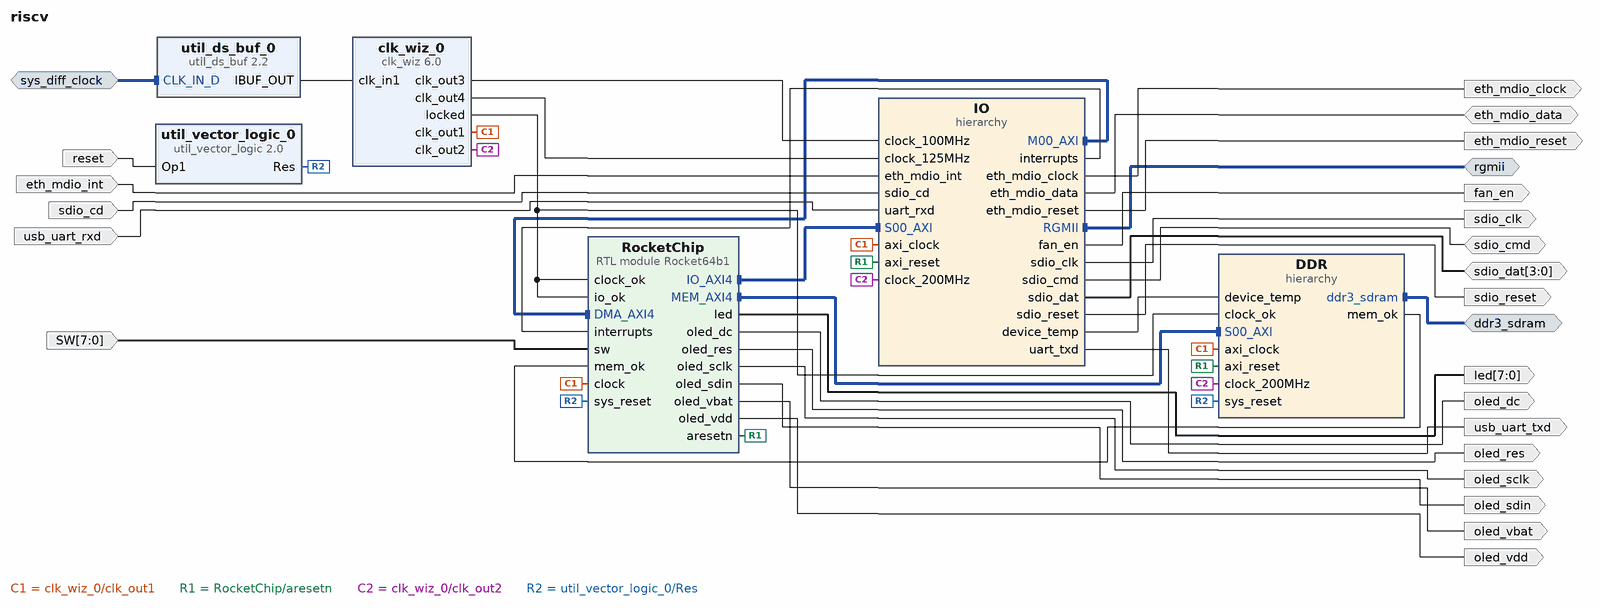
[diagram p0: block diagram of the top level]
# Vivado block design riscv, xc7k325tffg900-2, Vivado 2021.2
create_bd_design riscv

create_bd_intf_port -mode Master -vlnv xilinx.com:interface:ddrx_rtl:1.0 ddr3_sdram
create_bd_intf_port -mode Master -vlnv xilinx.com:interface:rgmii_rtl:1.0 rgmii
create_bd_intf_port -mode Slave -vlnv xilinx.com:interface:diff_clock_rtl:1.0 sys_diff_clock
set_property -dict {CONFIG.FREQ_HZ 200000000} [get_bd_intf_ports sys_diff_clock]
create_bd_port -dir O -from 7 -to 0 led
create_bd_port -dir I -from 7 -to 0 SW
create_bd_port -dir O oled_sdin
create_bd_port -dir O oled_sclk
create_bd_port -dir O oled_dc
create_bd_port -dir O oled_res
create_bd_port -dir O oled_vbat
create_bd_port -dir O oled_vdd
create_bd_port -dir O eth_mdio_clock
create_bd_port -dir IO eth_mdio_data
create_bd_port -dir I eth_mdio_int
create_bd_port -dir O eth_mdio_reset
create_bd_port -dir O fan_en
create_bd_port -dir I -type rst reset
set_property -dict {CONFIG.POLARITY ACTIVE_LOW} [get_bd_ports reset]
create_bd_port -dir I sdio_cd
create_bd_port -dir O sdio_clk
create_bd_port -dir IO sdio_cmd
create_bd_port -dir IO -from 3 -to 0 sdio_dat
create_bd_port -dir O -type rst sdio_reset
create_bd_port -dir I usb_uart_rxd
create_bd_port -dir O usb_uart_txd

create_bd_cell -type hier DDR
create_bd_cell -type hier IO
create_bd_cell -type ip -vlnv xilinx.com:ip:clk_wiz:6.0 clk_wiz_0
set_property -dict [list \
  CONFIG.CLKOUT1_REQUESTED_OUT_FREQ 100.0 \
  CONFIG.CLKOUT2_REQUESTED_OUT_FREQ 200.000 \
  CONFIG.CLKOUT2_USED true \
  CONFIG.CLKOUT3_REQUESTED_OUT_FREQ 100.000 \
  CONFIG.CLKOUT3_USED true \
  CONFIG.CLKOUT4_REQUESTED_OUT_FREQ 125.000 \
  CONFIG.CLKOUT4_USED true \
  CONFIG.NUM_OUT_CLKS 4 \
  CONFIG.PRIM_SOURCE No_buffer \
  CONFIG.USE_PHASE_ALIGNMENT false \
  CONFIG.USE_RESET false \
] [get_bd_cells clk_wiz_0]
create_bd_cell -type ip -vlnv xilinx.com:ip:util_ds_buf:2.2 util_ds_buf_0
set_property -dict {CONFIG.DIFF_CLK_IN_BOARD_INTERFACE sys_diff_clock CONFIG.USE_BOARD_FLOW true} [get_bd_cells util_ds_buf_0]
create_bd_cell -type ip -vlnv xilinx.com:ip:util_vector_logic:2.0 util_vector_logic_0
set_property -dict {CONFIG.C_OPERATION not CONFIG.C_SIZE 1} [get_bd_cells util_vector_logic_0]
create_bd_cell -type module -reference Rocket64b1 RocketChip

# ---- hierarchy /DDR ----
current_bd_instance /DDR
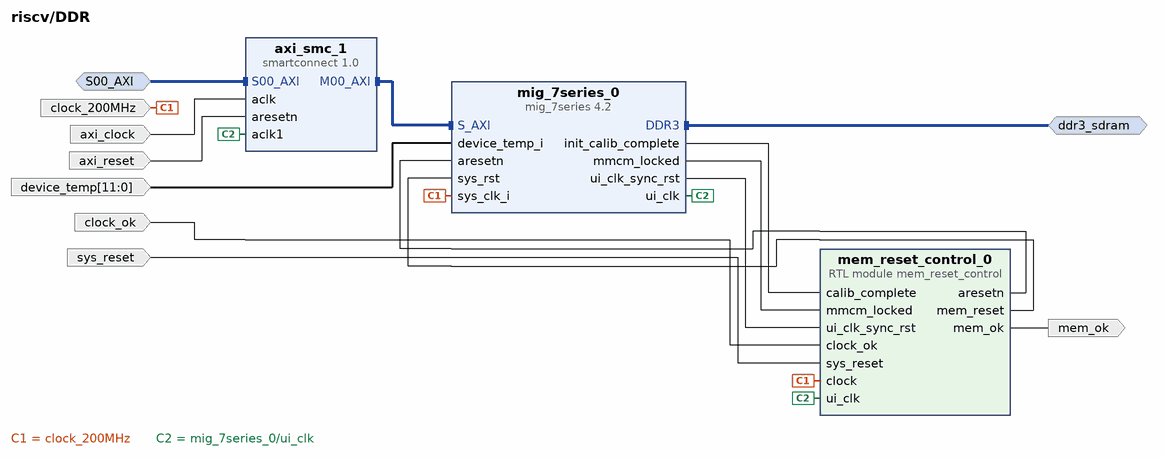
[diagram p1: block diagram inside /DDR]
create_bd_intf_pin -mode Slave -vlnv xilinx.com:interface:aximm_rtl:1.0 S00_AXI
create_bd_intf_pin -mode Master -vlnv xilinx.com:interface:ddrx_rtl:1.0 ddr3_sdram
create_bd_pin -dir I -type clk axi_clock
create_bd_pin -dir I -type rst axi_reset
create_bd_pin -dir I -type clk clock_200MHz
create_bd_pin -dir I clock_ok
create_bd_pin -dir I -from 11 -to 0 device_temp
create_bd_pin -dir O mem_ok
create_bd_pin -dir I -type rst sys_reset

create_bd_cell -type ip -vlnv xilinx.com:ip:smartconnect:1.0 axi_smc_1
set_property -dict {CONFIG.NUM_CLKS 2 CONFIG.NUM_SI 1} [get_bd_cells axi_smc_1]
create_bd_cell -type module -reference mem_reset_control mem_reset_control_0
create_bd_cell -type ip -vlnv xilinx.com:ip:mig_7series:4.2 mig_7series_0
set_property -dict [list \
  CONFIG.BOARD_MIG_PARAM ddr3_sdram \
  CONFIG.MIG_DONT_TOUCH_PARAM Custom \
  CONFIG.RESET_BOARD_INTERFACE Custom \
  CONFIG.XML_INPUT_FILE mig_a.prj \
] [get_bd_cells mig_7series_0]

# ---- hierarchy /IO ----
current_bd_instance /IO
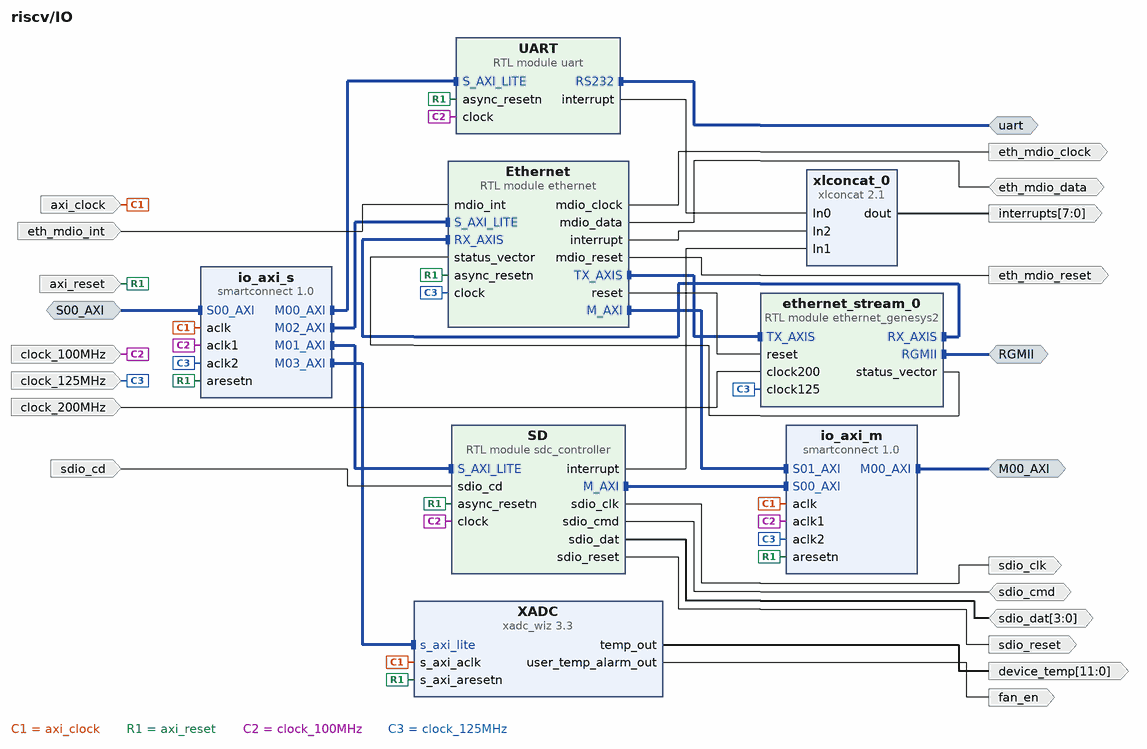
[diagram p2: block diagram inside /IO]
create_bd_intf_pin -mode Master -vlnv xilinx.com:interface:aximm_rtl:1.0 M00_AXI
create_bd_intf_pin -mode Master -vlnv xilinx.com:interface:rgmii_rtl:1.0 RGMII
create_bd_intf_pin -mode Slave -vlnv xilinx.com:interface:aximm_rtl:1.0 S00_AXI
create_bd_intf_pin -mode Master -vlnv xilinx.com:interface:uart_rtl:1.0 uart
create_bd_pin -dir I -type clk axi_clock
create_bd_pin -dir I -type rst axi_reset
create_bd_pin -dir I -type clk clock_100MHz
create_bd_pin -dir I -type clk clock_125MHz
create_bd_pin -dir I -type clk clock_200MHz
create_bd_pin -dir O -from 11 -to 0 device_temp
create_bd_pin -dir O eth_mdio_clock
create_bd_pin -dir IO eth_mdio_data
create_bd_pin -dir I eth_mdio_int
create_bd_pin -dir O eth_mdio_reset
create_bd_pin -dir O fan_en
create_bd_pin -dir O -from 7 -to 0 interrupts
create_bd_pin -dir I sdio_cd
create_bd_pin -dir O sdio_clk
create_bd_pin -dir IO sdio_cmd
create_bd_pin -dir IO -from 3 -to 0 sdio_dat
create_bd_pin -dir O sdio_reset

create_bd_cell -type module -reference ethernet Ethernet
create_bd_cell -type module -reference sdc_controller SD
set_property -dict {CONFIG.sdio_card_detect_level 0} [get_bd_cells SD]
create_bd_cell -type module -reference uart UART
create_bd_cell -type ip -vlnv xilinx.com:ip:xadc_wiz:3.3 XADC
set_property -dict [list \
  CONFIG.ADC_OFFSET_AND_GAIN_CALIBRATION true \
  CONFIG.ADC_OFFSET_CALIBRATION true \
  CONFIG.CHANNEL_ENABLE_VBRAM true \
  CONFIG.CHANNEL_ENABLE_VCCAUX true \
  CONFIG.CHANNEL_ENABLE_VCCINT true \
  CONFIG.CHANNEL_ENABLE_VP_VN true \
  CONFIG.ENABLE_TEMP_BUS true \
  CONFIG.SENSOR_OFFSET_AND_GAIN_CALIBRATION true \
  CONFIG.SENSOR_OFFSET_CALIBRATION true \
  CONFIG.SEQUENCER_MODE Continuous \
  CONFIG.TEMPERATURE_ALARM_RESET 50 \
  CONFIG.TEMPERATURE_ALARM_TRIGGER 60 \
  CONFIG.VCCAUX_ALARM false \
  CONFIG.VCCINT_ALARM false \
  CONFIG.XADC_STARUP_SELECTION channel_sequencer \
] [get_bd_cells XADC]
create_bd_cell -type module -reference ethernet_genesys2 ethernet_stream_0
create_bd_cell -type ip -vlnv xilinx.com:ip:smartconnect:1.0 io_axi_m
set_property -dict {CONFIG.NUM_CLKS 3 CONFIG.NUM_MI 1 CONFIG.NUM_SI 2} [get_bd_cells io_axi_m]
create_bd_cell -type ip -vlnv xilinx.com:ip:smartconnect:1.0 io_axi_s
set_property -dict {CONFIG.NUM_CLKS 3 CONFIG.NUM_MI 4 CONFIG.NUM_SI 1} [get_bd_cells io_axi_s]
create_bd_cell -type ip -vlnv xilinx.com:ip:xlconcat:2.1 xlconcat_0
set_property -dict {CONFIG.NUM_PORTS 8} [get_bd_cells xlconcat_0]

# ---- connections ----

current_bd_instance /DDR
connect_bd_intf_net -intf_net MEM_AXI4 [get_bd_intf_pins S00_AXI] [get_bd_intf_pins axi_smc_1/S00_AXI]
connect_bd_intf_net [get_bd_intf_pins axi_smc_1/M00_AXI] [get_bd_intf_pins mig_7series_0/S_AXI]
connect_bd_intf_net [get_bd_intf_pins ddr3_sdram] [get_bd_intf_pins mig_7series_0/DDR3]
connect_bd_net [get_bd_pins axi_clock] [get_bd_pins axi_smc_1/aclk]
connect_bd_net [get_bd_pins axi_reset] [get_bd_pins axi_smc_1/aresetn]
connect_bd_net [get_bd_pins clock_200MHz] [get_bd_pins mem_reset_control_0/clock] [get_bd_pins mig_7series_0/sys_clk_i]
connect_bd_net [get_bd_pins clock_ok] [get_bd_pins mem_reset_control_0/clock_ok]
connect_bd_net [get_bd_pins device_temp] [get_bd_pins mig_7series_0/device_temp_i]
connect_bd_net -net mem_aresetn [get_bd_pins mem_reset_control_0/aresetn] [get_bd_pins mig_7series_0/aresetn]
connect_bd_net -net mem_init_calib_complete [get_bd_pins mig_7series_0/init_calib_complete] [get_bd_pins mem_reset_control_0/calib_complete]
connect_bd_net -net mem_mmcm_locked [get_bd_pins mig_7series_0/mmcm_locked] [get_bd_pins mem_reset_control_0/mmcm_locked]
connect_bd_net -net mem_ok [get_bd_pins mem_reset_control_0/mem_ok] [get_bd_pins mem_ok]
connect_bd_net -net mem_reset [get_bd_pins mem_reset_control_0/mem_reset] [get_bd_pins mig_7series_0/sys_rst]
connect_bd_net -net mem_ui_clk [get_bd_pins mig_7series_0/ui_clk] [get_bd_pins mem_reset_control_0/ui_clk] [get_bd_pins axi_smc_1/aclk1]
connect_bd_net -net mem_ui_clk_sync_rst [get_bd_pins mig_7series_0/ui_clk_sync_rst] [get_bd_pins mem_reset_control_0/ui_clk_sync_rst]
connect_bd_net [get_bd_pins sys_reset] [get_bd_pins mem_reset_control_0/sys_reset]

current_bd_instance /IO
connect_bd_intf_net -intf_net Ethernet_RGMII [get_bd_intf_pins RGMII] [get_bd_intf_pins ethernet_stream_0/RGMII]
connect_bd_intf_net [get_bd_intf_pins Ethernet/TX_AXIS] [get_bd_intf_pins ethernet_stream_0/TX_AXIS]
connect_bd_intf_net [get_bd_intf_pins Ethernet/M_AXI] [get_bd_intf_pins io_axi_m/S01_AXI]
connect_bd_intf_net [get_bd_intf_pins uart] [get_bd_intf_pins UART/RS232]
connect_bd_intf_net [get_bd_intf_pins Ethernet/RX_AXIS] [get_bd_intf_pins ethernet_stream_0/RX_AXIS]
connect_bd_intf_net [get_bd_intf_pins M00_AXI] [get_bd_intf_pins io_axi_m/M00_AXI]
connect_bd_intf_net [get_bd_intf_pins S00_AXI] [get_bd_intf_pins io_axi_s/S00_AXI]
connect_bd_intf_net [get_bd_intf_pins UART/S_AXI_LITE] [get_bd_intf_pins io_axi_s/M00_AXI]
connect_bd_intf_net [get_bd_intf_pins SD/S_AXI_LITE] [get_bd_intf_pins io_axi_s/M01_AXI]
connect_bd_intf_net [get_bd_intf_pins Ethernet/S_AXI_LITE] [get_bd_intf_pins io_axi_s/M02_AXI]
connect_bd_intf_net [get_bd_intf_pins XADC/s_axi_lite] [get_bd_intf_pins io_axi_s/M03_AXI]
connect_bd_intf_net -intf_net sd_axi_m [get_bd_intf_pins SD/M_AXI] [get_bd_intf_pins io_axi_m/S00_AXI]
connect_bd_net [get_bd_pins axi_clock] [get_bd_pins XADC/s_axi_aclk] [get_bd_pins io_axi_m/aclk] [get_bd_pins io_axi_s/aclk]
connect_bd_net [get_bd_pins axi_reset] \
  [get_bd_pins Ethernet/async_resetn] [get_bd_pins SD/async_resetn] [get_bd_pins UART/async_resetn] \
  [get_bd_pins XADC/s_axi_aresetn] [get_bd_pins io_axi_m/aresetn] [get_bd_pins io_axi_s/aresetn]
connect_bd_net [get_bd_pins Ethernet/interrupt] [get_bd_pins xlconcat_0/In2]
connect_bd_net [get_bd_pins Ethernet/mdio_clock] [get_bd_pins eth_mdio_clock]
connect_bd_net -net Ethernet_mdio_data [get_bd_pins eth_mdio_data] [get_bd_pins Ethernet/mdio_data]
connect_bd_net -net Ethernet_mdio_int [get_bd_pins eth_mdio_int] [get_bd_pins Ethernet/mdio_int]
connect_bd_net [get_bd_pins Ethernet/mdio_reset] [get_bd_pins eth_mdio_reset]
connect_bd_net [get_bd_pins Ethernet/reset] [get_bd_pins ethernet_stream_0/reset]
connect_bd_net -net Ethernet_status [get_bd_pins ethernet_stream_0/status_vector] [get_bd_pins Ethernet/status_vector]
connect_bd_net [get_bd_pins SD/interrupt] [get_bd_pins xlconcat_0/In1]
connect_bd_net -net SD_sdio_cd [get_bd_pins sdio_cd] [get_bd_pins SD/sdio_cd]
connect_bd_net [get_bd_pins SD/sdio_clk] [get_bd_pins sdio_clk]
connect_bd_net -net SD_sdio_cmd [get_bd_pins sdio_cmd] [get_bd_pins SD/sdio_cmd]
connect_bd_net -net SD_sdio_dat [get_bd_pins sdio_dat] [get_bd_pins SD/sdio_dat]
connect_bd_net [get_bd_pins SD/sdio_reset] [get_bd_pins sdio_reset]
connect_bd_net [get_bd_pins UART/interrupt] [get_bd_pins xlconcat_0/In0]
connect_bd_net [get_bd_pins clock_100MHz] [get_bd_pins SD/clock] [get_bd_pins UART/clock] [get_bd_pins io_axi_m/aclk1] [get_bd_pins io_axi_s/aclk1]
connect_bd_net [get_bd_pins clock_125MHz] \
  [get_bd_pins Ethernet/clock] [get_bd_pins ethernet_stream_0/clock125] [get_bd_pins io_axi_m/aclk2] \
  [get_bd_pins io_axi_s/aclk2]
connect_bd_net [get_bd_pins clock_200MHz] [get_bd_pins ethernet_stream_0/clock200]
connect_bd_net -net device_temp [get_bd_pins XADC/temp_out] [get_bd_pins device_temp]
connect_bd_net -net fan_en [get_bd_pins XADC/user_temp_alarm_out] [get_bd_pins fan_en]
connect_bd_net -net interrupts [get_bd_pins xlconcat_0/dout] [get_bd_pins interrupts]

current_bd_instance /
connect_bd_intf_net [get_bd_intf_ports ddr3_sdram] [get_bd_intf_pins DDR/ddr3_sdram]
connect_bd_intf_net [get_bd_intf_ports rgmii] [get_bd_intf_pins IO/RGMII]
connect_bd_intf_net [get_bd_intf_pins DDR/S00_AXI] [get_bd_intf_pins RocketChip/MEM_AXI4]
connect_bd_intf_net -intf_net io_axi_m [get_bd_intf_pins IO/M00_AXI] [get_bd_intf_pins RocketChip/DMA_AXI4]
connect_bd_intf_net -intf_net io_axi_s [get_bd_intf_pins IO/S00_AXI] [get_bd_intf_pins RocketChip/IO_AXI4]
connect_bd_intf_net [get_bd_intf_ports sys_diff_clock] [get_bd_intf_pins util_ds_buf_0/CLK_IN_D]
connect_bd_net -net AXI_clock [get_bd_pins clk_wiz_0/clk_out1] [get_bd_pins DDR/axi_clock] [get_bd_pins IO/axi_clock] [get_bd_pins RocketChip/clock]
connect_bd_net -net AXI_reset [get_bd_pins RocketChip/aresetn] [get_bd_pins DDR/axi_reset] [get_bd_pins IO/axi_reset]
connect_bd_net [get_bd_pins IO/eth_mdio_clock] [get_bd_ports eth_mdio_clock]
connect_bd_net -net IO_eth_mdio_data [get_bd_ports eth_mdio_data] [get_bd_pins IO/eth_mdio_data]
connect_bd_net -net IO_eth_mdio_int [get_bd_ports eth_mdio_int] [get_bd_pins IO/eth_mdio_int]
connect_bd_net [get_bd_pins IO/eth_mdio_reset] [get_bd_ports eth_mdio_reset]
connect_bd_net [get_bd_pins IO/interrupts] [get_bd_pins RocketChip/interrupts]
connect_bd_net -net IO_sdio_cd [get_bd_ports sdio_cd] [get_bd_pins IO/sdio_cd]
connect_bd_net [get_bd_pins IO/sdio_clk] [get_bd_ports sdio_clk]
connect_bd_net -net IO_sdio_cmd [get_bd_ports sdio_cmd] [get_bd_pins IO/sdio_cmd]
connect_bd_net -net IO_sdio_dat [get_bd_ports sdio_dat] [get_bd_pins IO/sdio_dat]
connect_bd_net [get_bd_pins IO/sdio_reset] [get_bd_ports sdio_reset]
connect_bd_net -net IO_uart_rxd [get_bd_ports usb_uart_rxd] [get_bd_pins IO/uart_rxd]
connect_bd_net [get_bd_pins IO/uart_txd] [get_bd_ports usb_uart_txd]
connect_bd_net [get_bd_pins RocketChip/led] [get_bd_ports led]
connect_bd_net [get_bd_pins RocketChip/oled_dc] [get_bd_ports oled_dc]
connect_bd_net [get_bd_pins RocketChip/oled_res] [get_bd_ports oled_res]
connect_bd_net [get_bd_pins RocketChip/oled_sclk] [get_bd_ports oled_sclk]
connect_bd_net [get_bd_pins RocketChip/oled_sdin] [get_bd_ports oled_sdin]
connect_bd_net [get_bd_pins RocketChip/oled_vbat] [get_bd_ports oled_vbat]
connect_bd_net [get_bd_pins RocketChip/oled_vdd] [get_bd_ports oled_vdd]
connect_bd_net [get_bd_ports SW] [get_bd_pins RocketChip/sw]
connect_bd_net -net clock_100MHz [get_bd_pins clk_wiz_0/clk_out3] [get_bd_pins IO/clock_100MHz]
connect_bd_net -net clock_125MHz [get_bd_pins clk_wiz_0/clk_out4] [get_bd_pins IO/clock_125MHz]
connect_bd_net -net clock_200MHz [get_bd_pins clk_wiz_0/clk_out2] [get_bd_pins DDR/clock_200MHz] [get_bd_pins IO/clock_200MHz]
connect_bd_net -net clock_ok [get_bd_pins clk_wiz_0/locked] \
  [get_bd_pins DDR/clock_ok] [get_bd_pins RocketChip/clock_ok] [get_bd_pins RocketChip/io_ok]
connect_bd_net -net device_temp [get_bd_pins IO/device_temp] [get_bd_pins DDR/device_temp]
connect_bd_net -net fan_en [get_bd_pins IO/fan_en] [get_bd_ports fan_en]
connect_bd_net -net mem_ok [get_bd_pins DDR/mem_ok] [get_bd_pins RocketChip/mem_ok]
connect_bd_net -net reset_h [get_bd_pins util_vector_logic_0/Res] [get_bd_pins DDR/sys_reset] [get_bd_pins RocketChip/sys_reset]
connect_bd_net -net reset_l [get_bd_ports reset] [get_bd_pins util_vector_logic_0/Op1]
connect_bd_net -net sys_clock [get_bd_pins util_ds_buf_0/IBUF_OUT] [get_bd_pins clk_wiz_0/clk_in1]

# ---- address map ----
assign_bd_address -offset 0x00000000 -range 4G -target_address_space [get_bd_addr_spaces IO/Ethernet/M_AXI] [get_bd_addr_segs RocketChip/DMA_AXI4/reg0]
assign_bd_address -offset 0x00000000 -range 4G -target_address_space [get_bd_addr_spaces IO/SD/M_AXI] [get_bd_addr_segs RocketChip/DMA_AXI4/reg0]
assign_bd_address -offset 0x60000000 -range 64K -target_address_space [get_bd_addr_spaces RocketChip/IO_AXI4] [get_bd_addr_segs IO/SD/S_AXI_LITE/reg0]
assign_bd_address -offset 0x60010000 -range 64K -target_address_space [get_bd_addr_spaces RocketChip/IO_AXI4] [get_bd_addr_segs IO/UART/S_AXI_LITE/reg0]
assign_bd_address -offset 0x60020000 -range 64K -target_address_space [get_bd_addr_spaces RocketChip/IO_AXI4] [get_bd_addr_segs IO/Ethernet/S_AXI_LITE/reg0]
assign_bd_address -offset 0x60030000 -range 64K -target_address_space [get_bd_addr_spaces RocketChip/IO_AXI4] [get_bd_addr_segs IO/XADC/s_axi_lite/Reg]
assign_bd_address -offset 0x80000000 -range 1G -target_address_space [get_bd_addr_spaces RocketChip/MEM_AXI4] [get_bd_addr_segs DDR/mig_7series_0/memmap/memaddr]

validate_bd_design
save_bd_design
